# EAGLE schematic MSP_Lunchbox_OpenSource_v1 (EAGLE 9.5.2)
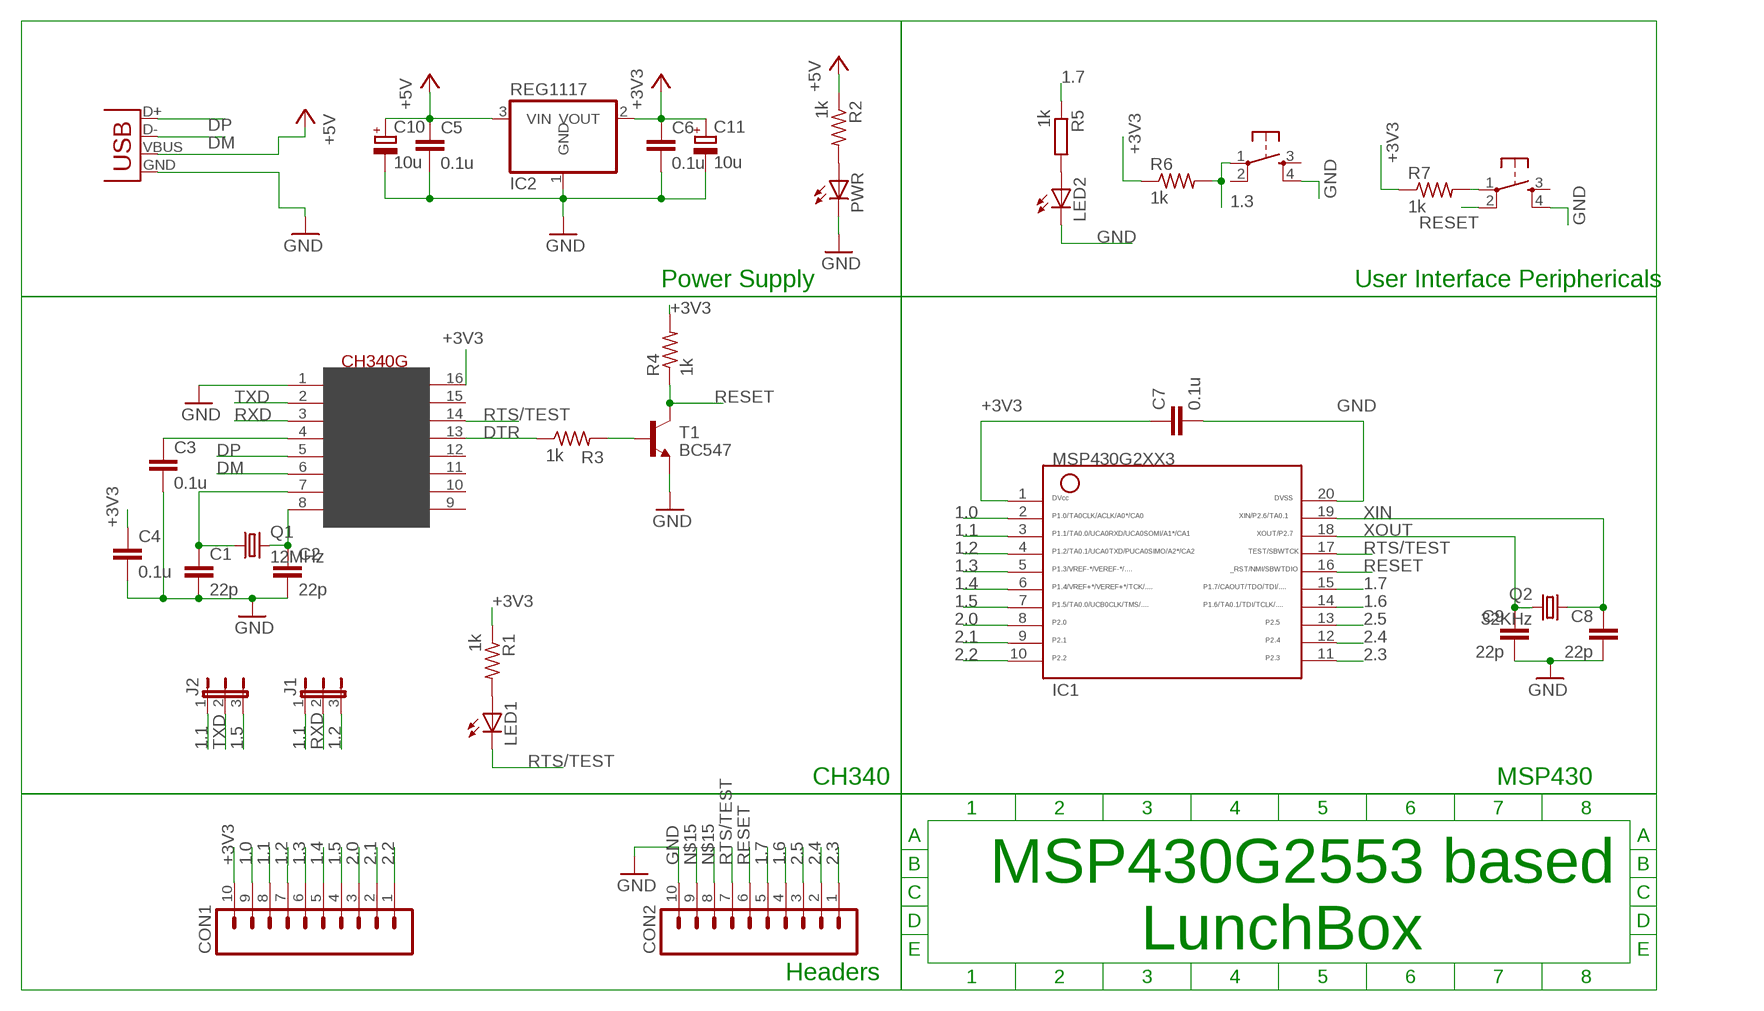
[diagram p0: schematic, sheet 1]

## Parts
C1  22p  C-EUC0805  [C0805]
C2  22p  C-EUC0805  [C0805]
C3  0.1u  C-EUC0805  [C0805]
C4  0.1u  C-EUC0805  [C0805]
C5  0.1u  C-EUC0805  [C0805]
C6  0.1u  C-EUC0805  [C0805]
C7  0.1u  C-EU075-032X103  [C075-032X103]
C8  22p  C-EUC0805  [C0805]
C9  22p  C-EUC0805  [C0805]
C10  10u  CPOL-EUB/3528-21R  [B/3528-21R]
C11  10u  CPOL-EUB/3528-21R  [B/3528-21R]
CH340  CH340  CH340G  [SOIC16]
CON1  M10  [10P]
CON2  M10  [10P]
IC1  MSP430G2553DIP20  [G2553-DIP20]
IC2  REG1117  [SOT223]
J1  JP2E  [JP2]
J2  JP2E  [JP2]
LED1  LED3MM  [LED3MM]
LED2  LED3MM  [LED3MM]
PWR  LED3MM  [LED3MM]
Q1  12MHz  CRYSTALHC49US  [HC49US]
Q2  32KHz  CRYSTALTC26H  [TC26H]
R1  1k  R-US_0207/10  [0207/10]
R2  1k  R-US_0207/10  [0207/10]
R3  1k  R-US_0207/10  [0207/10]
R4  1k  R-US_0207/10  [0207/10]
R5  1k  R-EU_0207/12  [0207/12]
R6  1k  R-US_0204/7  [0204/7]
R7  1k  R-US_0204/7  [0204/7]
RESET  OMRON_SWITCH_10-XX  [B3F-10XX]
SW1  OMRON_SWITCH_10-XX  [B3F-10XX]
T1  BC547  [TO92]
X2  USBSMD  [USB-MINIB]

## Nets
1.0: CON1.9 IC1.2
1.1: CON1.8 IC1.3 J1.1 J2.1
1.2: CON1.7 IC1.4 J1.3
1.3: CON1.6 IC1.5 R6.2 SW1.1(P)
1.4: CON1.5 IC1.6
1.5: CON1.4 IC1.7 J2.3
1.6: CON2.4 IC1.14
1.7: CON2.5 IC1.15 R5.1
2.0: CON1.3 IC1.8
2.1: CON1.2 IC1.9
2.2: CON1.1 IC1.10
2.3: CON2.1 IC1.11
2.4: CON2.2 IC1.12
2.5: CON2.3 IC1.13
+3V3: C4.1 C6.1 C7.1 C11.+ CH340.16(VCC) CON1.10 IC1.1 IC2.2(VOUT) R1.1 R4.2 R6.1 R7.1
+5V: C5.1 C10.+ IC2.3(VIN) R2.1 X2.VBUS
DM: CH340.6(D-) X2.D-
DP: CH340.5(D+) X2.D+
DTR: CH340.13(DTR) R3.1
GND: C1.2 C2.2 C3.2 C4.2 C5.2 C6.2 C7.2 C8.2 C9.2 C10.- C11.- CH340.1(GND) CON2.10 IC1.20 IC2.1(GND) LED2.K(C) PWR.K(C) RESET.4(S1) SW1.4(S1) T1.1(E) X2.GND
N$1: LED1.A R1.2
N$2: PWR.A R2.2
N$3: C1.1 CH340.7(XI) Q1.1
N$4: C2.1 CH340.8(XO) Q1.2
N$5: LED2.A R5.2
N$6: R7.2 RESET.1(P)
N$10: R3.2 T1.2(B)
N$11: C3.1 CH340.4(V3)
N$14: CON2.9
N$15: CON2.8
RESET: CON2.6 IC1.16 R4.1 RESET.2(P1) T1.3(C)
RTS/TEST: CH340.14(RTS) CON2.7 IC1.17 LED1.K(C)
RXD: CH340.3(RX) J1.2
TXD: CH340.2(TX) J2.2
XIN: C8.1 IC1.19 Q2.1
XOUT: C9.1 IC1.18 Q2.2
Unconnected: CH340.9(CTS) CH340.10(DSR) CH340.11(RI) CH340.12(DCD) CH340.15(RS232) RESET.3(S) SW1.2(P1) SW1.3(S)

## Notes on the sheet
- Power Supply | User Interface Periphericals
- CH340 | MSP430
- MSP430G2553 based
- LunchBox
- Headers

## Library data of the parts
C1-C9 = rcl:C-EU: CAPACITOR, European symbol
C10 C11 = rcl:CPOL-EU: POLARIZED CAPACITOR, European symbol
CH340 = usb-serial:CH340G
CON1 CON2 = con-amp-quick:M10: AMP QUICK CONNECTOR; OC_FARNELL: unknown; OC_NEWARK: unknown
IC1 = CEDT_JANUARY_2015_v5:MSP430G2553
IC2 = CEDT_JANUARY_2015_v5:REG1117: 800mA and 1A Low Dropout (LDO) Positive Regulator 1.8V, 2.5V, 2.85V, 3.3V, 5V, and Adj
J1 J2 = jumper:JP2E: JUMPER
LED1 LED2 PWR = CEDT_JANUARY_2015_v5_a:LED
Q1 = CEDT_JANUARY_2015_v4:CRYSTAL: Crystals Various standard crystals. Proven footprints. Spark Fun Electronics SKU : COM-00534
Q2 = CEDT_JANUARY_2015_v5:CRYSTAL: Crystals Various standard crystals. Proven footprints. Spark Fun Electronics SKU : COM-00534
R1-R4 R6 R7 = rcl:R-US_: RESISTOR, American symbol
R5 = rcl:R-EU_: RESISTOR, European symbol
RESET SW1 = CEDT_JANUARY_2015_v5:OMRON_SWITCH
T1 = msp framework:BC547: NPN TRANSISTOR Datasheet <https://www.fairchildsemi.com/datasheets/BC/BC547.pdf>
X2 = CEDTv82:USB: USB Connectors USB-B-PTH is fully proven SKU : PRT-00139 USB-miniB is fully proven SKU : PRT-00587 USB-A-PCB is untested. USB-A-H is throughly reviewed, but untested. Spark Fun Electronics SKU : PRT-00437 USB-B-SMT is throughly reviewed, but untested. Needs silkscreen touching up. USB-A-S has not been used/tested USB-MB-H has not been used/tested